# Altium schematic sheet 07_nRF_GPIO.SchDoc: SENSEI Base Board - nRF GPIO
size A3; DrawnBy: Sebastian Frey; Organization: Integrated Systems Laboratory; DocumentNumber: 8; Revision: v1.1; SheetNumber: 8; SheetTotal: 12
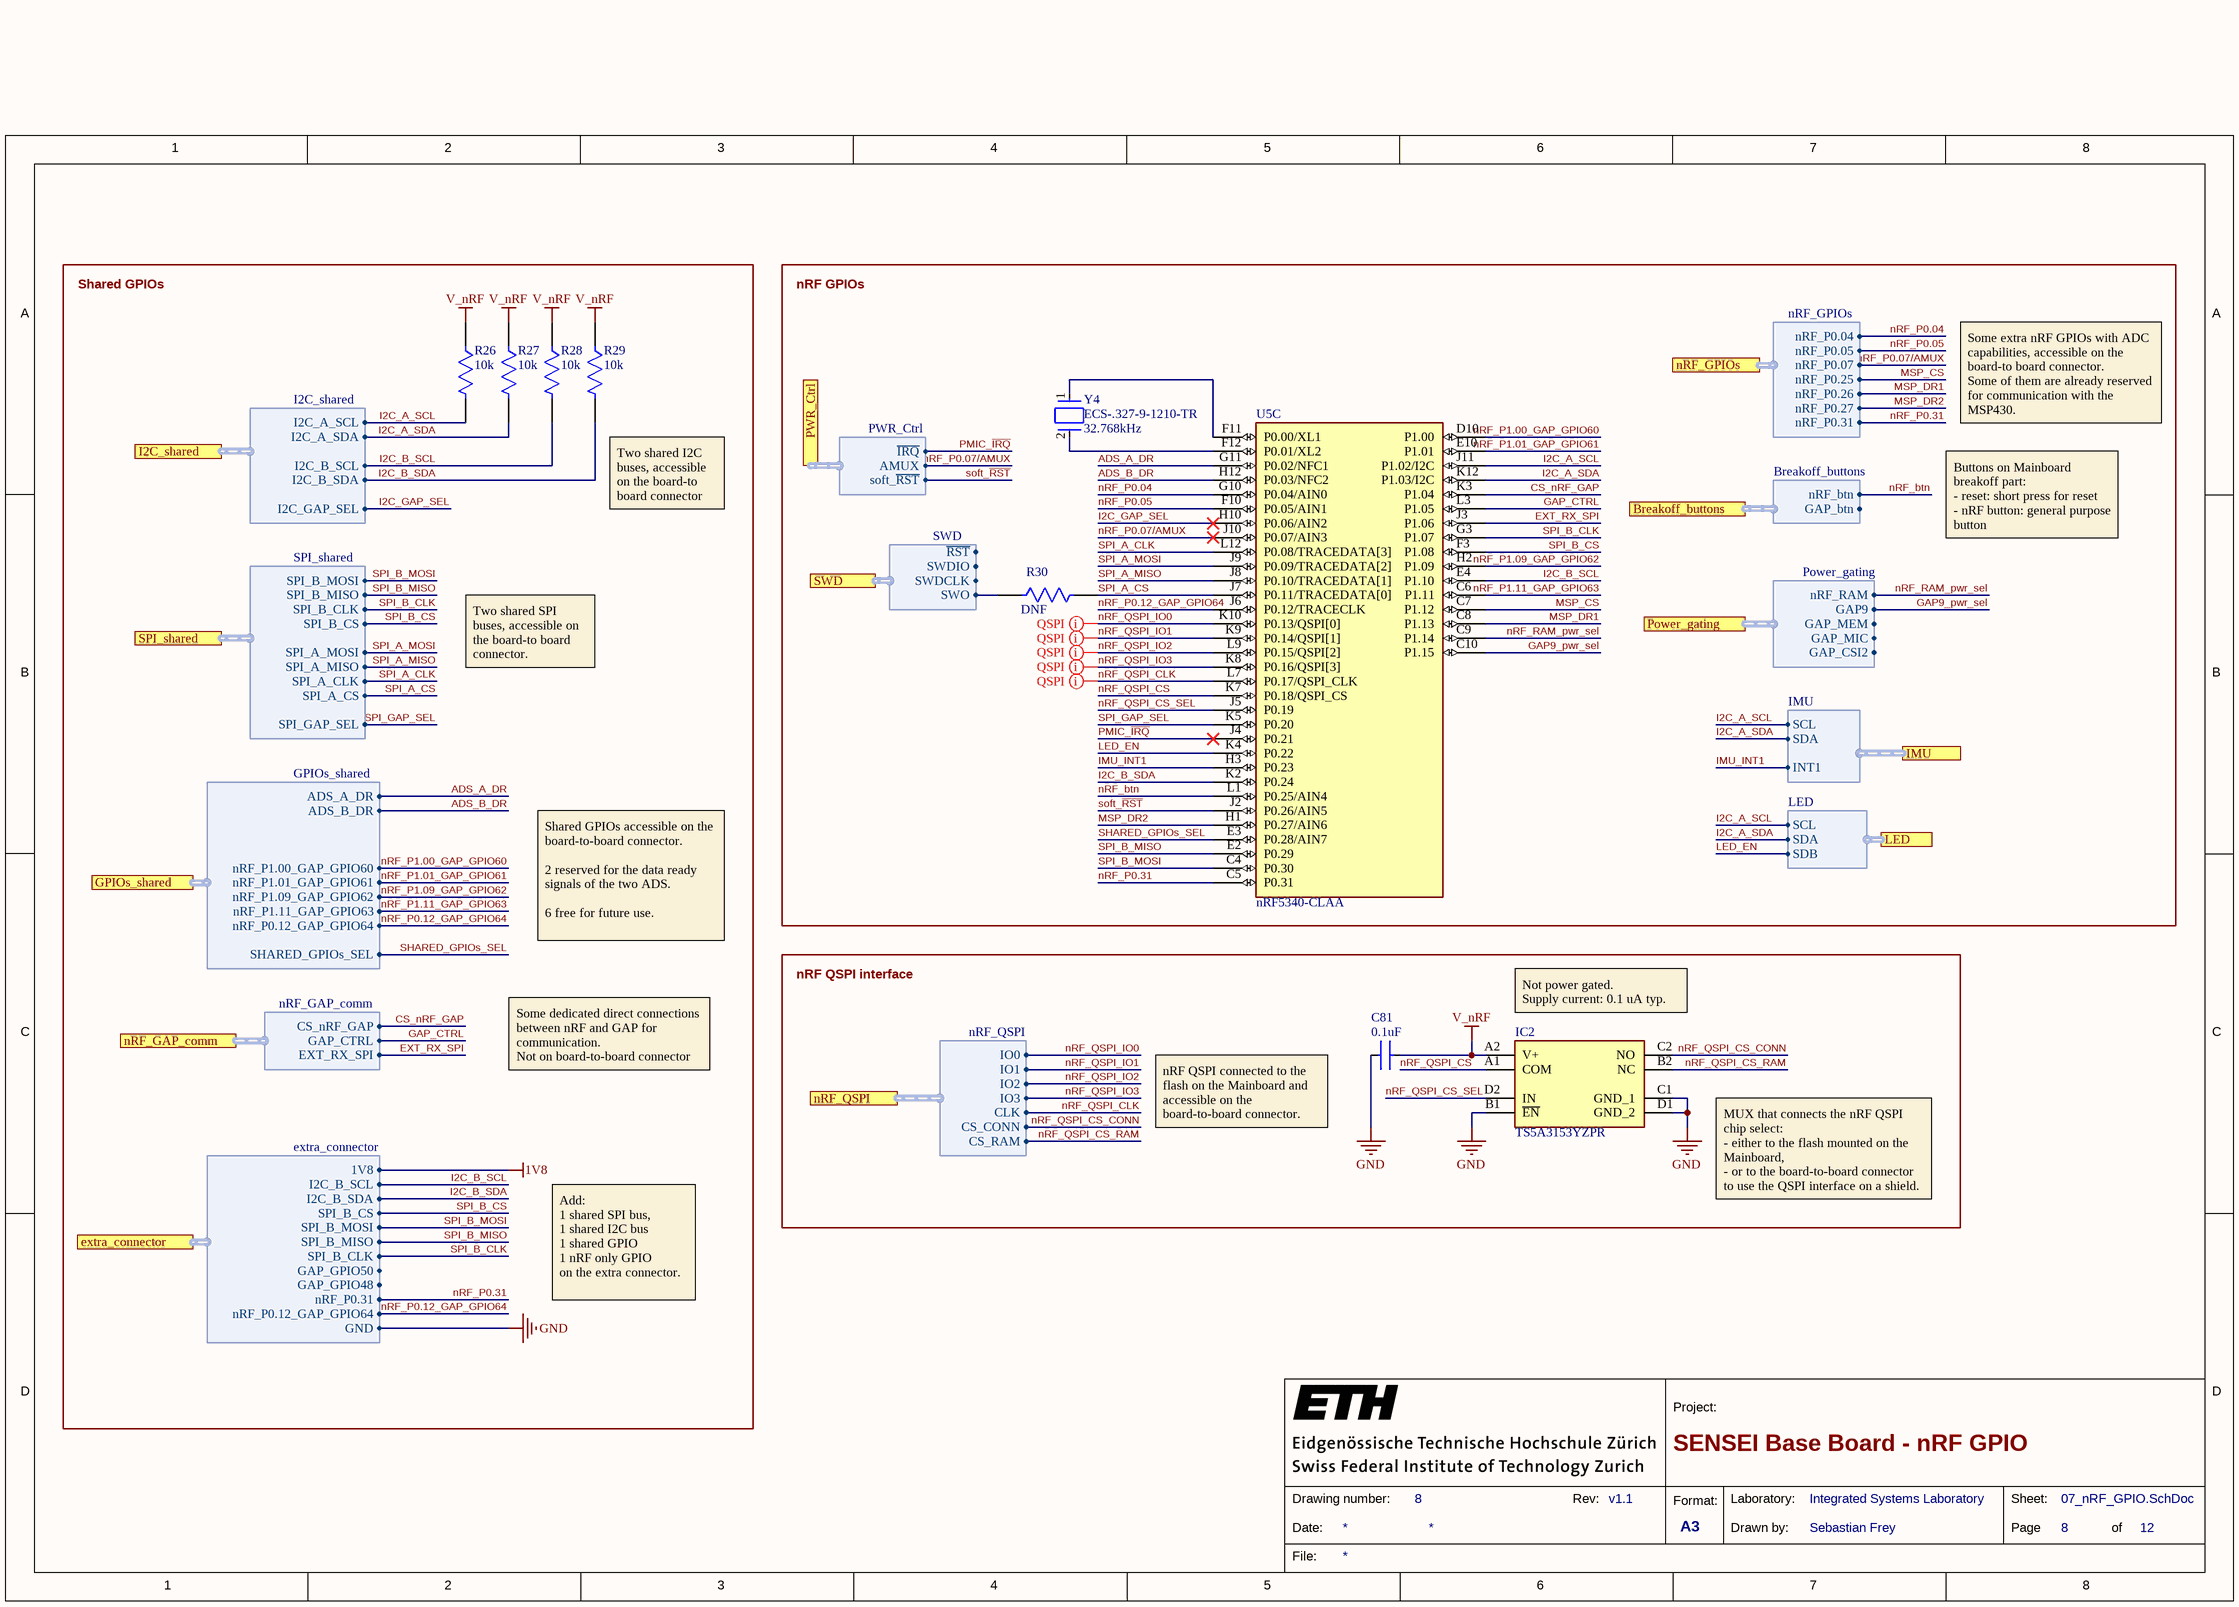
[diagram p0: 07_nRF_GPIO.SchDoc]

## Parts
C81  Capacitance: 0.1uF  [FP-GRM033-0_03-IPC_C]  (hidden comment: GRM033Z71C104KE14D)
IC2  TS5A3153YZPR  [BGA8C50P2X4_89X189X50]
R26  Resistance: 10k  [FP-RMCF0201-IPC_C]  (hidden comment: RMCF0201FT10K0)
R27  Resistance: 10k  [FP-RMCF0201-IPC_C]  (hidden comment: RMCF0201FT10K0)
R28  Resistance: 10k  [FP-RMCF0201-IPC_C]  (hidden comment: RMCF0201FT10K0)
R29  Resistance: 10k  [FP-RMCF0201-IPC_C]  (hidden comment: RMCF0201FT10K0)
R30  DNF  [FP-RMCF0201-IPC_C]
U5  nRF5340-CLAA  [NRF5340_WLCSP]  (part C of 3)
Y4  ECS-.327-9-1210-TR  Frequency: 32.768kHz  [FP-ECX-1210-MFG]

## Blocks framed on the sheet
Shared GPIOs: R26-R29
nRF GPIOs: R30 U5 Y4
nRF QSPI interface: C81 IC2

## Ports
Breakoff_buttons (harness Breakoff_buttons), extra_connector (harness extra_connector), GPIOs_shared (harness GPIOs_shared), I2C_shared (harness I2C_shared), IMU (harness IMU), LED (harness LED), nRF_GAP_comm (harness nRF_GAP_comm), nRF_GPIOs (harness nRF_GPIOs), nRF_QSPI (harness nRF_QSPI), Power_gating (harness Power_gating), PWR_Ctrl (harness PWR_Ctrl), SPI_shared (harness SPI_shared), SWD (harness SWD)

## Harnesses
nRF_QSPI: IO0, IO1, IO2, IO3, CLK, CS_CONN, CS_RAM
LED: SCL, SDA, SDB
SPI_shared: SPI_B_MOSI, SPI_B_MISO, SPI_B_CLK, SPI_B_CS, SPI_A_MOSI, SPI_A_MISO, SPI_A_CLK, SPI_A_CS, SPI_GAP_SEL
I2C_shared: I2C_A_SCL, I2C_A_SDA, I2C_B_SCL, I2C_B_SDA, I2C_GAP_SEL
IMU: SCL, SDA, INT1
Breakoff_buttons: nRF_btn, GAP_btn
nRF_GAP_comm: CS_nRF_GAP, GAP_CTRL, EXT_RX_SPI
GPIOs_shared: ADS_A_DR, ADS_B_DR, nRF_P1.00_GAP_GPIO60, nRF_P1.09_GAP_GPIO62, nRF_P1.11_GAP_GPIO63, nRF_P0.12_GAP_GPIO64, SHARED_GPIOs_SEL, nRF_P1.01_GAP_GPIO61
nRF_GPIOs: nRF_P0.07, nRF_P0.25, nRF_P0.05, nRF_P0.04, nRF_P0.26, nRF_P0.27, nRF_P0.31
extra_connector: SPI_B_CS, SPI_B_MOSI, SPI_B_MISO, SPI_B_CLK, GAP_GPIO50, GAP_GPIO48, I2C_B_SDA, nRF_P0.12_GAP_GPIO64, GND, I2C_B_SCL, 1V8, nRF_P0.31
SWD: ~{RST}, SWDIO, SWDCLK, SWO
Power_gating: nRF_RAM, GAP9, GAP_MEM, GAP_MIC, GAP_CSI2
PWR_Ctrl: ~{IRQ}, AMUX, soft_~{RST}

## Nets
1V8: port extra_connector.1V8
GND: C81.2 IC2.B1(~{EN}) IC2.C1(GND_1) IC2.D1(GND_2) ; port extra_connector.GND
V_nRF: C81.1 IC2.A2(V+) R26.1 R27.1 R28.1 R29.1
ADS_A_DR: U5.G11(P0.02/NFC1) ; port GPIOs_shared.ADS_A_DR
ADS_B_DR: U5.H12(P0.03/NFC2) ; port GPIOs_shared.ADS_B_DR
CS_nRF_GAP: U5.K3(P1.04) ; port nRF_GAP_comm.CS_nRF_GAP
EXT_RX_SPI: U5.J3(P1.06) ; port nRF_GAP_comm.EXT_RX_SPI
GAP9_pwr_sel: U5.C10(P1.15) ; port Power_gating.GAP9
GAP_CTRL: U5.L3(P1.05) ; port nRF_GAP_comm.GAP_CTRL
I2C_A_SCL: R26.2 U5.J11(P1.02/I2C) ; port LED.SCL, port I2C_shared.I2C_A_SCL, port IMU.SCL
I2C_A_SDA: R27.2 U5.K12(P1.03/I2C) ; port LED.SDA, port I2C_shared.I2C_A_SDA, port IMU.SDA
I2C_B_SCL: R28.2 U5.E4(P1.10) ; port I2C_shared.I2C_B_SCL, port extra_connector.I2C_B_SCL
I2C_B_SDA: R29.2 U5.K2(P0.24) ; port I2C_shared.I2C_B_SDA, port extra_connector.I2C_B_SDA
I2C_GAP_SEL: U5.H10(P0.06/AIN2) ; port I2C_shared.I2C_GAP_SEL
IMU_INT1: U5.H3(P0.23) ; port IMU.INT1
LED_EN: U5.K4(P0.22) ; port LED.SDB
MSP_CS: U5.C7(P1.12) ; port nRF_GPIOs.nRF_P0.25
MSP_DR1: U5.C8(P1.13) ; port nRF_GPIOs.nRF_P0.26
MSP_DR2: U5.H1(P0.27/AIN6) ; port nRF_GPIOs.nRF_P0.27
nRF_btn: U5.L1(P0.25/AIN4) ; port Breakoff_buttons.nRF_btn
nRF_P0.04: U5.G10(P0.04/AIN0) ; port nRF_GPIOs.nRF_P0.04
nRF_P0.05: U5.F10(P0.05/AIN1) ; port nRF_GPIOs.nRF_P0.05
nRF_P0.07/AMUX: U5.J10(P0.07/AIN3) ; port nRF_GPIOs.nRF_P0.07, port PWR_Ctrl.AMUX
nRF_P0.12_GAP_GPIO64: U5.J6(P0.12/TRACECLK) ; port GPIOs_shared.nRF_P0.12_GAP_GPIO64, port extra_connector.nRF_P0.12_GAP_GPIO64
nRF_P0.31: U5.C5(P0.31) ; port nRF_GPIOs.nRF_P0.31, port extra_connector.nRF_P0.31
nRF_P1.00_GAP_GPIO60: U5.D10(P1.00) ; port GPIOs_shared.nRF_P1.00_GAP_GPIO60
nRF_P1.01_GAP_GPIO61: U5.E10(P1.01) ; port GPIOs_shared.nRF_P1.01_GAP_GPIO61
nRF_P1.09_GAP_GPIO62: U5.H2(P1.09) ; port GPIOs_shared.nRF_P1.09_GAP_GPIO62
nRF_P1.11_GAP_GPIO63: U5.C6(P1.11) ; port GPIOs_shared.nRF_P1.11_GAP_GPIO63
nRF_QSPI_CLK: U5.L7(P0.17/QSPI_CLK) ; port nRF_QSPI.CLK
nRF_QSPI_CS: IC2.A1(COM) U5.K7(P0.18/QSPI_CS)
nRF_QSPI_CS_CONN: IC2.C2(NO) ; port nRF_QSPI.CS_CONN
nRF_QSPI_CS_RAM: IC2.B2(NC) ; port nRF_QSPI.CS_RAM
nRF_QSPI_CS_SEL: IC2.D2(IN) U5.J5(P0.19)
nRF_QSPI_IO0: U5.K10(P0.13/QSPI[0]) ; port nRF_QSPI.IO0
nRF_QSPI_IO1: U5.K9(P0.14/QSPI[1]) ; port nRF_QSPI.IO1
nRF_QSPI_IO2: U5.L9(P0.15/QSPI[2]) ; port nRF_QSPI.IO2
nRF_QSPI_IO3: U5.K8(P0.16/QSPI[3]) ; port nRF_QSPI.IO3
nRF_RAM_pwr_sel: U5.C9(P1.14) ; port Power_gating.nRF_RAM
PMIC_~{IRQ}: U5.J4(P0.21) ; port PWR_Ctrl.~{IRQ}
SHARED_GPIOs_SEL: U5.E3(P0.28/AIN7) ; port GPIOs_shared.SHARED_GPIOs_SEL
soft_~{RST}: U5.J2(P0.26/AIN5) ; port PWR_Ctrl.soft_~{RST}
SPI_A_CLK: U5.L12(P0.08/TRACEDATA[3]) ; port SPI_shared.SPI_A_CLK
SPI_A_CS: R30.2 U5.J7(P0.11/TRACEDATA[0]) ; port SPI_shared.SPI_A_CS
SPI_A_MISO: U5.J8(P0.10/TRACEDATA[1]) ; port SPI_shared.SPI_A_MISO
SPI_A_MOSI: U5.J9(P0.09/TRACEDATA[2]) ; port SPI_shared.SPI_A_MOSI
SPI_B_CLK: U5.G3(P1.07) ; port SPI_shared.SPI_B_CLK, port extra_connector.SPI_B_CLK
SPI_B_CS: U5.F3(P1.08) ; port SPI_shared.SPI_B_CS, port extra_connector.SPI_B_CS
SPI_B_MISO: U5.E2(P0.29) ; port SPI_shared.SPI_B_MISO, port extra_connector.SPI_B_MISO
SPI_B_MOSI: U5.C4(P0.30) ; port SPI_shared.SPI_B_MOSI, port extra_connector.SPI_B_MOSI
SPI_GAP_SEL: U5.K5(P0.20) ; port SPI_shared.SPI_GAP_SEL
NetR30_1: R30.1 ; port SWD.SWO
NetU5_F11: U5.F11(P0.00/XL1) Y4.1(In/Out)
NetU5_F12: U5.F12(P0.01/XL2) Y4.2(Out/In)

## Layout directives
net class Q_SPI: nRF_QSPI_CLK, nRF_QSPI_IO0, nRF_QSPI_IO1, nRF_QSPI_IO2, nRF_QSPI_IO3

## Notes on the sheet
- Some extra nRF GPIOs with ADC capabilities, accessible on the board-to board connector.
  Some of them are already reserved for communication with the MSP430.
- Two shared I2C buses, accessible on the board-to board connector
- Buttons on Mainboard breakoff part:
  - reset: short press for reset
  - nRF button: general purpose button
- Two shared SPI buses, accessible on the board-to board connector.
- Shared GPIOs accessible on the board-to-board connector.
  2 reserved for the data ready signals of the two ADS.
  6 free for future use.
- (near IC2) Not power gated.
  Supply current: 0.1 uA typ.
- Some dedicated direct connections between nRF and GAP for communication.
  Not on board-to-board connector
- (near C81) nRF QSPI connected to the flash on the Mainboard and accessible on the board-to-board connector.
- MUX that connects the nRF QSPI chip select:
  - either to the flash mounted on the Mainboard,
  - or to the board-to-board connector to use the QSPI interface on a shield.
- Add:
  1 shared SPI bus,
  1 shared I2C bus
  1 shared GPIO
  1 nRF only GPIO
  on the extra connector.
- 1
- 2
- 3
- 4
- 5
- 6
- 7
- 8
- A
- B
- C
- D
- Project:
- Date:
- Drawing number:
- Rev:
- Format:
- A3
- Drawn by:
- Laboratory:
- Page
- Sheet:
- of
- File:

## Library data of the parts
C81 = CMP-06035-035508-1: Chip Multilayer Ceramic Capacitors for General Purpose, 0201, 0.10uF, X7R, 15%, 10%, 16V; Case/Package: 0201
IC2 = TS5A3153YZPR: Integrated Circuit; Manufacturer_Name: Texas Instruments; Datasheet Link: http://www.ti.com/lit/gpn/ts5a3153; Height: 0.5mm; Manufacturer_Part_Number: TS5A3153YZPR; Mouser Part Number: 595-TS5A3153YZPR; Mouser Price/Stock: https://www.mouser.co.uk/ProductDetail/Texas-Instruments/TS5A3153YZPR?qs=BBezV1N05%2FtCq%2FSrTOTYog%3D%3D
R26-R29 = CMP-26527-002755-1: RES 10K OHM 1% 1/20W 0201; Max Power Dissipation: 50mW; Temperature Coefficient: 200ppm/°C; Length: 0.024inch; Min Operating Temperature: -55°C; Width: 0.012inch; Contact Plating: Tin; Case/Package: 0201; Power Rating: 50mW; Packaging: Tape and Reel; Resistor Type: Thick Film; Case Code (Metric): 0603; Tolerance: 1%; Case Code (Imperial): 0201; Max Operating Temperature: 125°C; Height: 0.009inch; Mount: Surface Mount; Series: RMCF; RoHS Compliant: Yes; Number of Terminations: 2
R30 = CMP-26527-001890-1
U5 = nRF5340-CLAA: Multi-protocol Bluetooth Low Energy, IEEE 802.15.4, ANT and 2.4GHz proprietary system-on-chip; Manufacturer: Nordic; Manufacturer Part Number: NRF5340-CLAA-R7; Supplier 1: Mouser; Supplier Part Number 1: 949-NRF5340-CLAA-R7
Y4 = CMP-40224-000031-1: CRYSTAL 32.7680KHZ 9PF SMD; Frequency Tolerance: 20ppm; ESR (Equivalent Series Resistance): 90kR; Load Capacitance: 9pF; Case/Package: SMD/SMT; Max Operating Temperature: 85°C; Min Operating Temperature: -40°C; Packaging: Tape and Reel; RoHS Compliant: Yes; Mount: Surface Mount